# EAGLE design ETHIOLED (EAGLE 9.6.2)
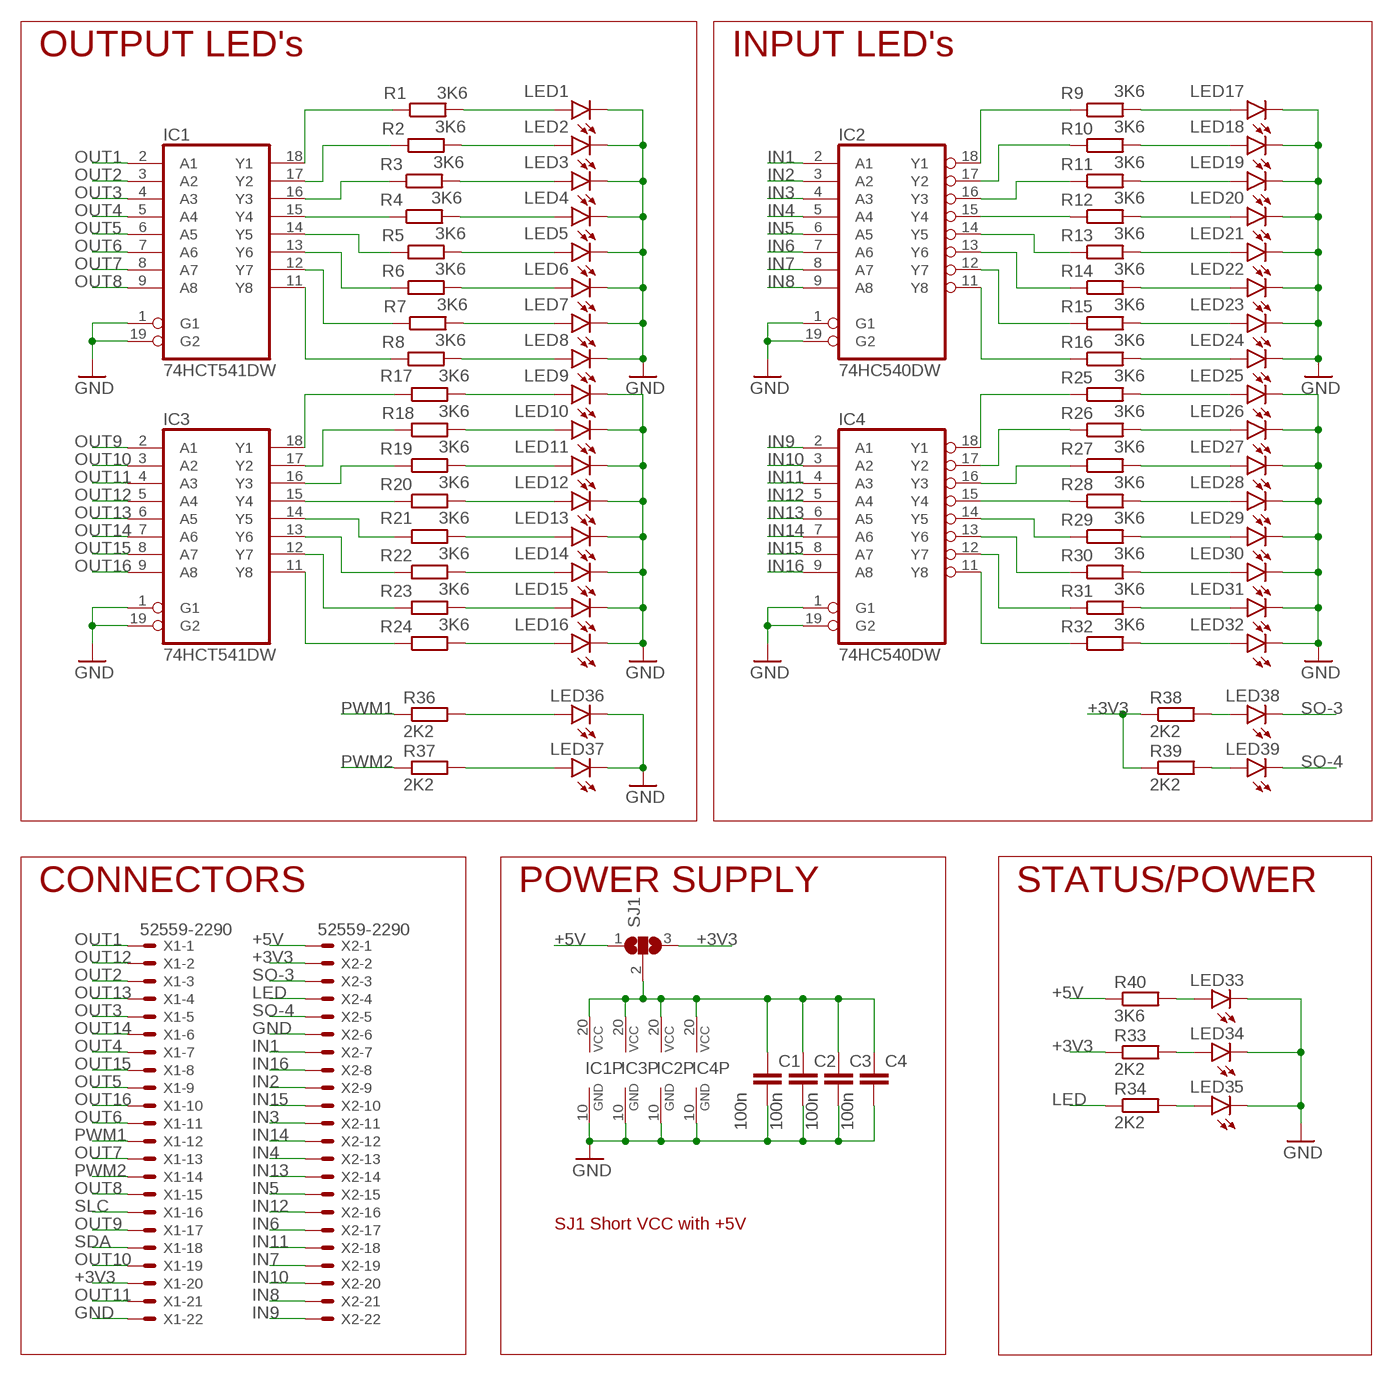
[diagram p0: schematic, sheet 1]

## Parts
C1  100n  C-EUC0805  [C0805]
C2  100n  C-EUC0805  [C0805]
C3  100n  C-EUC0805  [C0805]
C4  100n  C-EUC0805  [C0805]
IC1  74HCT541DW  [SO20W]
IC2  74HC540DW  [SO20W]
IC3  74HCT541DW  [SO20W]
IC4  74HC540DW  [SO20W]
LED1  LEDSML1206  [SML1206]
LED2  LEDSML1206  [SML1206]
LED3  LEDSML1206  [SML1206]
LED4  LEDSML1206  [SML1206]
LED5  LEDSML1206  [SML1206]
LED6  LEDSML1206  [SML1206]
LED7  LEDSML1206  [SML1206]
LED8  LEDSML1206  [SML1206]
LED9  LEDSML1206  [SML1206]
LED10  LEDSML1206  [SML1206]
LED11  LEDSML1206  [SML1206]
LED12  LEDSML1206  [SML1206]
LED13  LEDSML1206  [SML1206]
LED14  LEDSML1206  [SML1206]
LED15  LEDSML1206  [SML1206]
LED16  LEDSML1206  [SML1206]
LED17  LEDSML1206  [SML1206]
LED18  LEDSML1206  [SML1206]
LED19  LEDSML1206  [SML1206]
LED20  LEDSML1206  [SML1206]
LED21  LEDSML1206  [SML1206]
LED22  LEDSML1206  [SML1206]
LED23  LEDSML1206  [SML1206]
LED24  LEDSML1206  [SML1206]
LED25  LEDSML1206  [SML1206]
LED26  LEDSML1206  [SML1206]
LED27  LEDSML1206  [SML1206]
LED28  LEDSML1206  [SML1206]
LED29  LEDSML1206  [SML1206]
LED30  LEDSML1206  [SML1206]
LED31  LEDSML1206  [SML1206]
LED32  LEDSML1206  [SML1206]
LED33  LEDSML1206  [SML1206]
LED34  LEDSML1206  [SML1206]
LED35  LEDSML1206  [SML1206]
LED36  LEDSML1206  [SML1206]
LED37  LEDSML1206  [SML1206]
LED38  LEDSML1206  [SML1206]
LED39  LEDSML1206  [SML1206]
R1  3K6  R-EU_R0805  [R0805]
R2  3K6  R-EU_R0805  [R0805]
R3  3K6  R-EU_R0805  [R0805]
R4  3K6  R-EU_R0805  [R0805]
R5  3K6  R-EU_R0805  [R0805]
R6  3K6  R-EU_R0805  [R0805]
R7  3K6  R-EU_R0805  [R0805]
R8  3K6  R-EU_R0805  [R0805]
R9  3K6  R-EU_R0805  [R0805]
R10  3K6  R-EU_R0805  [R0805]
R11  3K6  R-EU_R0805  [R0805]
R12  3K6  R-EU_R0805  [R0805]
R13  3K6  R-EU_R0805  [R0805]
R14  3K6  R-EU_R0805  [R0805]
R15  3K6  R-EU_R0805  [R0805]
R16  3K6  R-EU_R0805  [R0805]
R17  3K6  R-EU_R0805  [R0805]
R18  3K6  R-EU_R0805  [R0805]
R19  3K6  R-EU_R0805  [R0805]
R20  3K6  R-EU_R0805  [R0805]
R21  3K6  R-EU_R0805  [R0805]
R22  3K6  R-EU_R0805  [R0805]
R23  3K6  R-EU_R0805  [R0805]
R24  3K6  R-EU_R0805  [R0805]
R25  3K6  R-EU_R0805  [R0805]
R26  3K6  R-EU_R0805  [R0805]
R27  3K6  R-EU_R0805  [R0805]
R28  3K6  R-EU_R0805  [R0805]
R29  3K6  R-EU_R0805  [R0805]
R30  3K6  R-EU_R0805  [R0805]
R31  3K6  R-EU_R0805  [R0805]
R32  3K6  R-EU_R0805  [R0805]
R33  2K2  R-EU_R1206  [R1206]
R34  2K2  R-EU_R1206  [R1206]
R36  2K2  R-EU_R0805  [R0805]
R37  2K2  R-EU_R0805  [R0805]
R38  2K2  R-EU_R0805  [R0805]
R39  2K2  R-EU_R0805  [R0805]
R40  3K6  R-EU_R1206  [R1206]
SJ1  SJ2W  [SJ_2]
X1  52559-2290  [52559-2290]
X2  52559-2290  [52559-2290]

## Nets
+3V3: R33.1 R38.1 R39.1 SJ1.3 X1.20 X2.2
+5V: R40.1 SJ1.1 X2.1
GND: C1.2 C2.2 C3.2 C4.2 IC1.1(G1) IC1.10(GND) IC1.19(G2) IC2.1(G1) IC2.10(GND) IC2.19(G2) IC3.1(G1) IC3.10(GND) IC3.19(G2) IC4.1(G1) IC4.10(GND) IC4.19(G2) LED1.C LED2.C LED3.C LED4.C LED5.C LED6.C LED7.C LED8.C LED9.C LED10.C LED11.C LED12.C LED13.C LED14.C LED15.C LED16.C LED17.C LED18.C LED19.C LED20.C LED21.C LED22.C LED23.C LED24.C LED25.C LED26.C LED27.C LED28.C LED29.C LED30.C LED31.C LED32.C LED33.C LED34.C LED35.C LED36.C LED37.C X1.22 X2.6
I1: IC2.18(Y1) R9.1
I16: IC4.11(Y8) R32.1
IN1: IC2.2(A1) X2.7
IN2: IC2.3(A2) X2.9
IN3: IC2.4(A3) X2.11
IN4: IC2.5(A4) X2.13
IN5: IC2.6(A5) X2.15
IN6: IC2.7(A6) X2.17
IN7: IC2.8(A7) X2.19
IN8: IC2.9(A8) X2.21
IN9: IC4.2(A1) X2.22
IN10: IC4.3(A2) X2.20
IN11: IC4.4(A3) X2.18
IN12: IC4.5(A4) X2.16
IN13: IC4.6(A5) X2.14
IN14: IC4.7(A6) X2.12
IN15: IC4.8(A7) X2.10
IN16: IC4.9(A8) X2.8
LED: R34.1 X2.4
N$2: IC3.12(Y7) R23.1
N$3: IC3.13(Y6) R22.1
N$4: IC3.14(Y5) R21.1
N$5: IC3.15(Y4) R20.1
N$6: IC3.16(Y3) R19.1
N$7: IC3.17(Y2) R18.1
N$8: IC3.18(Y1) R17.1
N$10: IC2.17(Y2) R10.1
N$11: IC2.16(Y3) R11.1
N$12: IC2.15(Y4) R12.1
N$13: IC2.14(Y5) R13.1
N$14: IC2.13(Y6) R14.1
N$15: IC2.12(Y7) R15.1
N$16: IC2.11(Y8) R16.1
N$17: IC1.11(Y8) R8.1
N$18: IC1.12(Y7) R7.1
N$19: IC1.13(Y6) R6.1
N$20: IC1.14(Y5) R5.1
N$21: IC1.15(Y4) R4.1
N$22: IC1.16(Y3) R3.1
N$23: IC1.17(Y2) R2.1
N$25: IC4.18(Y1) R25.1
N$26: IC4.17(Y2) R26.1
N$27: IC4.16(Y3) R27.1
N$28: IC4.15(Y4) R28.1
N$29: IC4.14(Y5) R29.1
N$30: IC4.13(Y6) R30.1
N$31: IC4.12(Y7) R31.1
N$33: LED1.A R1.2
N$34: LED2.A R2.2
N$35: LED3.A R3.2
N$36: LED4.A R4.2
N$37: LED5.A R5.2
N$38: LED6.A R6.2
N$39: LED7.A R7.2
N$40: LED8.A R8.2
N$41: LED36.A R36.2
N$42: LED37.A R37.2
N$43: LED9.A R17.2
N$44: LED10.A R18.2
N$45: LED11.A R19.2
N$46: LED12.A R20.2
N$47: LED13.A R21.2
N$48: LED14.A R22.2
N$49: LED15.A R23.2
N$50: LED16.A R24.2
N$51: LED17.A R9.2
N$52: LED18.A R10.2
N$53: LED19.A R11.2
N$54: LED20.A R12.2
N$55: LED21.A R13.2
N$56: LED22.A R14.2
N$57: LED23.A R15.2
N$58: LED24.A R16.2
N$59: LED25.A R25.2
N$60: LED26.A R26.2
N$61: LED27.A R27.2
N$62: LED28.A R28.2
N$63: LED29.A R29.2
N$64: LED30.A R30.2
N$65: LED31.A R31.2
N$66: LED32.A R32.2
N$67: LED33.A R40.2
N$68: LED34.A R33.2
N$69: C1.1 C2.1 C3.1 C4.1 IC1.20(VCC) IC2.20(VCC) IC3.20(VCC) IC4.20(VCC) SJ1.2
N$70: LED35.A R34.2
N$71: LED38.A R38.2
N$73: LED39.A R39.2
OUT1: IC1.2(A1) X1.1
OUT2: IC1.3(A2) X1.3
OUT3: IC1.4(A3) X1.5
OUT4: IC1.5(A4) X1.7
OUT5: IC1.6(A5) X1.9
OUT6: IC1.7(A6) X1.11
OUT7: IC1.8(A7) X1.13
OUT8: IC1.9(A8) X1.15
OUT9: IC3.2(A1) X1.17
OUT10: IC3.3(A2) X1.19
OUT11: IC3.4(A3) X1.21
OUT12: IC3.5(A4) X1.2
OUT13: IC3.6(A5) X1.4
OUT14: IC3.7(A6) X1.6
OUT15: IC3.8(A7) X1.8
OUT16: IC3.9(A8) X1.10
PWM1: R36.1 X1.12
PWM2: R37.1 X1.14
SDA: X1.18
SLC: X1.16
SO-3: LED38.C X2.3
SO-4: LED39.C X2.5
UT1: IC1.18(Y1) R1.1
UT16: IC3.11(Y8) R24.1

## Notes on the sheet
- OUTPUT LED's | INPUT LED's
- CONNECTORS | POWER SUPPLY | STATUS/POWER
- SJ1 Short VCC with +5V

## Library data of the parts
C1-C4 = rcl:C-EU: CAPACITOR, European symbol; SPICEPREFIX: C
IC1 IC3 = 74xx-eu:74*541: Octal BUFFER and LINE DRIVER, 3-state
IC2 IC4 = 74xx-eu:74*540: Inverting Octal BUFFER and LINE DRIVER, 3-state
LED1-LED39 = led:LED: LED OSRAM: - CHIPLED LG R971, LG N971, LY N971, LG Q971, LY Q971, LO R971, LY R971 LH N974, LH R974 LS Q976, LO Q976, LY Q976 LO Q996 - Hyper CHIPLED LW Q18S LB Q993, LB Q99A, LB R99A - SideLED LS A670, LO A670, LY A670, LG A670, LP A670 LB A673, LV A673, LT A673, LW A673 LH A674 LY A675 LS A676, LA A676, LO A676, LY A676, LW A676 LS A679, LY A679, LG A679 - Hyper Micro SIDELED® LS Y876, LA Y876, LO Y876, LY Y876 LT Y87S - SmartLED LW L88C, LW L88S LB L89C, LB L89S, LG L890 LS L89K, LO L89K, LY L89K LS L896, LA L896, LO L896, LY L896 - TOPLED LS T670, LO T670, LY T670, LG T670, LP T670 LSG T670, LSP T670, LSY T670, LOP T670, LYG T670 LG T671, LOG T671, LSG T671 LB T673, LV T673, LT T673, LW T673 LH T674 LS T676, LA T676, LO T676, LY T676, LB T676, LH T676, LSB T676, LW T676 LB T67C, LV T67C, LT T67C, LS T67K, LO T67K, LY T67K, LW E67C LS E67B, LA E67B, LO E67B, LY E67B, LB E67C, LV E67C, LT E67C LW T67C LS T679, LY T679, LG T679 LS T770, LO T770, LY T770, LG T770, LP T770 LB T773, LV T773, LT T773, LW T773 LH T774 LS E675, LA E675, LY E675, LS T675 LS T776, LA T776, LO T776, LY T776, LB T776 LHGB T686 LT T68C, LB T68C - Hyper Mini TOPLED® LB M676 - Mini TOPLED Santana® LG M470 LS M47K, LO M47K, LY M47K Source: http://www.osram.convergy.de LUXEON: - LUMILED® LXK2-PW12-R00, LXK2-PW12-S00, LXK2-PW14-U00, LXK2-PW14-V00 LXK2-PM12-R00, LXK2-PM12-S00, LXK2-PM14-U00 LXK2-PE12-Q00, LXK2-PE12-R00, LXK2-PE12-S00, LXK2-PE14-T00, LXK2-PE14-U00 LXK2-PB12-K00, LXK2-PB12-L00, LXK2-PB12-M00, LXK2-PB14-N00, LXK2-PB14-P00, LXK2-PB14-Q00 LXK2-PR12-L00, LXK2-PR12-M00, LXK2-PR14-Q00, LXK2-PR14-R00 LXK2-PD12-Q00, LXK2-PD12-R00, LXK2-PD12-S00 LXK2-PH12-R00, LXK2-PH12-S00 LXK2-PL12-P00, LXK2-PL12-Q00, LXK2-PL12-R00 Source: www.luxeon.com KINGBRIGHT: KA-3528ASYC Source: www.kingbright.com
R1-R34 R36-R40 = rcl:R-EU_: RESISTOR, European symbol; SPICEPREFIX: R
SJ1 = jumper:SJ2W: SMD solder JUMPER
X1 X2 = con-molex:52559-2290: FFC/FPC-to-Board 0.50mm (.020") SMT, Vertical, ZIF Receptacle Source: http://www.molex.com/product/ffc/52559.html; MF: MOLEX; MPN: 52559-2290; OC_FARNELL: unknown; OC_NEWARK: 92M6193

## Board
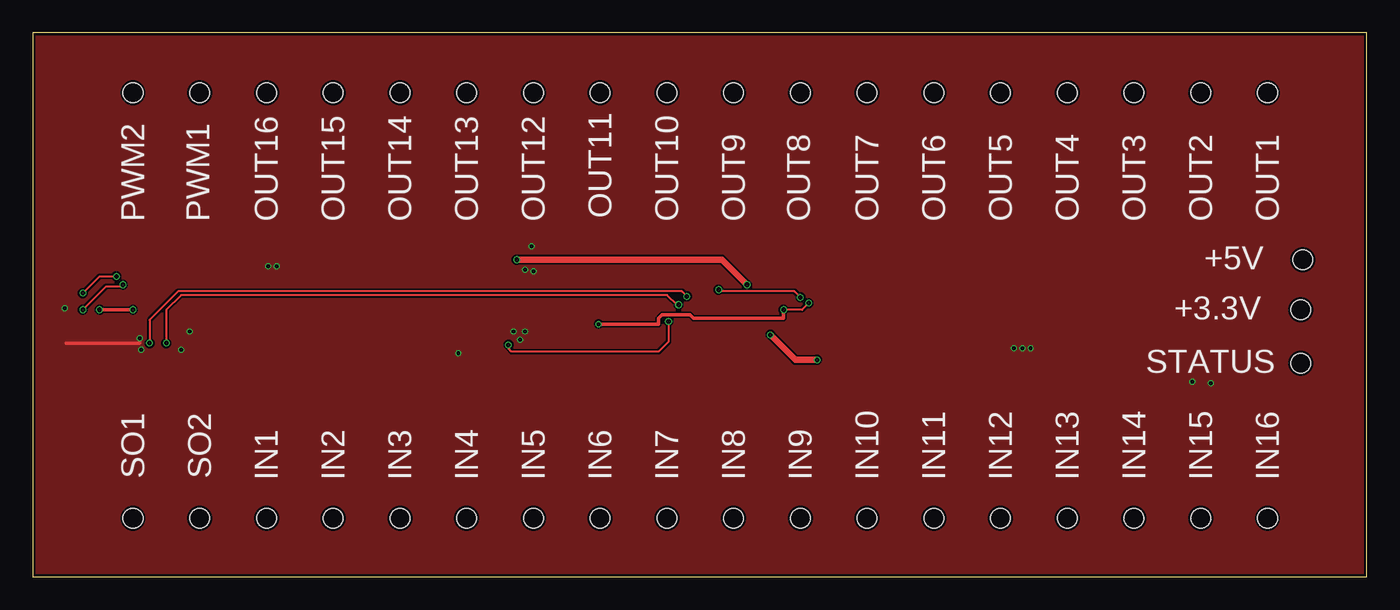
[diagram p1: board, top side]
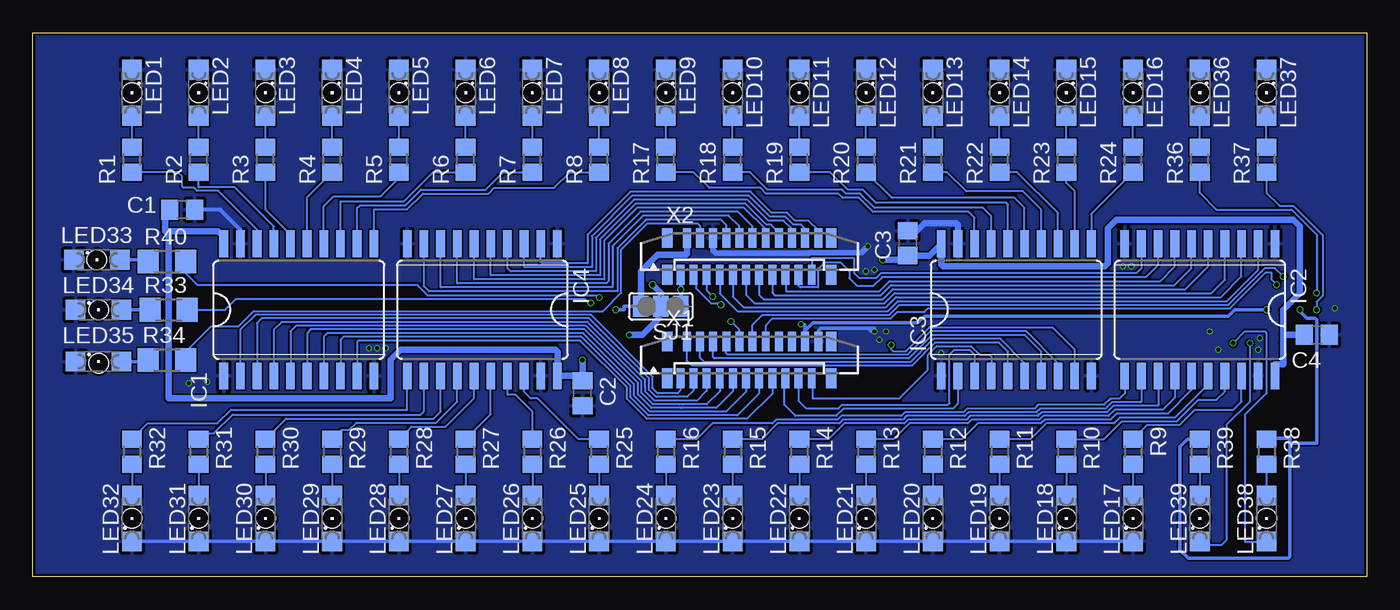
[diagram p2: board, bottom side, seen from below]

Size 101.52 x 41.39 mm. Coordinates in mm from the lower left corner, seen from the top.
Outline: 0,0 101.52,0 101.52,41.39 0,41.39 0,0
Copper layers (1*16): Top 0.035mm / dielectric 1.6mm / Bottom 0.035mm
Design rules "jlcpcb-2layers *": minimum track width 5mil, minimum drill 0.3mm, track to track 5mil, track to pad 5mil, pad to pad 5mil, via to via 5mil, smd to smd 5mil, copper to edge 0.2mm, drill to drill 6mil, minimum pad ring 10mil, minimum via ring 3mil, stop-mask expansion 4mil, vias tented up to drill 40mm, thermal gap 10mil
Holes 1.5 mm at 7.62,36.83 12.7,36.83 17.78,36.83 22.86,36.83 27.94,36.83 33.02,36.83 38.1,36.83 43.18,36.83 48.26,36.83 53.34,36.83 58.42,36.83 63.5,36.83 68.58,36.83 73.66,36.83 78.74,36.83 83.82,36.83 88.9,36.83 93.98,36.83 7.62,4.45 12.7,4.45 17.78,4.45 22.86,4.45 27.94,4.45 33.02,4.45 38.1,4.45 43.18,4.45 48.26,4.45 53.34,4.45 58.42,4.45 63.5,4.45 68.58,4.45 73.66,4.45 78.74,4.45 83.82,4.45 88.9,4.45 93.98,4.45 96.65,24.13 96.52,20.32 96.52,16.26

### Footprints (pad centres in the part's own frame; a part is rotated, then mirrored left to right if it is on the bottom)
C0805 = smd 1.3 x 1.5: 1 -0.95,0; 2 0.95,0
SO20W = smd 0.66 x 2.032: 1 -5.715,-5.029; 2 -4.445,-5.029; 3 -3.175,-5.029; 4 -1.905,-5.029; 5 -0.635,-5.029; 6 0.635,-5.029; 7 1.905,-5.029; 8 3.175,-5.029; 9 4.445,-5.029; 10 5.715,-5.029; 11 5.715,5.029; 12 4.445,5.029; 13 3.175,5.029; 14 1.905,5.029; 15 0.635,5.029; 16 -0.635,5.029; 17 -1.905,5.029; 18 -3.175,5.029; 19 -4.445,5.029; 20 -5.715,5.029
SML1206 = smd 1.5 x 1.5: A 1.75,0; C -1.75,0
R0805 = smd 1.3 x 1.5: 1 -0.95,0; 2 0.95,0
R1206 = smd 1.6 x 1.803: 1 -1.422,0; 2 1.422,0
SJ_2 = smd 1.168 x 1.6: 1 -1.524,0; 2 0,0; 3 1.524,0
52559-2290 = smd 0.6 x 1.5: 1 -5.25,-1.4; 2 -4.75,1.4; 3 -4.25,-1.4; 4 -3.75,1.4; 5 -3.25,-1.4; 6 -2.75,1.4; 7 -2.25,-1.4; 8 -1.75,1.4; 9 -1.25,-1.4; 10 -0.75,1.4; 11 -0.25,-1.4; 12 0.25,1.4; 13 0.75,-1.4; 14 1.25,1.4; 15 1.75,-1.4; 16 2.25,1.4; 17 2.75,-1.4; 18 3.25,1.4; 19 3.75,-1.4; 20 4.25,1.4; 21 4.75,-1.4; 22 5.25,1.4 | smd 0.8 x 1.5: M1 -6.25,-1.4; M2 6.25,-1.4; M3 6.25,1.4; M4 -6.25,1.4

### Placement (x,y rotation side)
C1  90.17,27.94 0 bottom
C2  59.69,13.97 270 bottom
C3  34.92,25.4 90 bottom
C4  3.81,18.41 0 bottom
IC1  81.28,20.32 0 bottom
IC2  12.7,20.32 180 bottom
IC3  26.67,20.32 0 bottom
IC4  67.31,20.32 180 bottom
LED1  93.98,36.83 270 bottom
LED2  88.9,36.83 270 bottom
LED3  83.82,36.83 270 bottom
LED4  78.74,36.83 270 bottom
LED5  73.66,36.83 270 bottom
LED6  68.58,36.83 270 bottom
LED7  63.5,36.83 270 bottom
LED8  58.42,36.83 270 bottom
LED9  53.34,36.83 270 bottom
LED10  48.26,36.83 270 bottom
LED11  43.18,36.83 270 bottom
LED12  38.1,36.83 270 bottom
LED13  33.02,36.83 270 bottom
LED14  27.94,36.83 270 bottom
LED15  22.86,36.83 270 bottom
LED16  17.78,36.83 270 bottom
LED17  17.78,4.45 90 bottom
LED18  22.86,4.45 90 bottom
LED19  27.94,4.45 90 bottom
LED20  33.02,4.45 90 bottom
LED21  38.1,4.45 90 bottom
LED22  43.18,4.45 90 bottom
LED23  48.26,4.45 90 bottom
LED24  53.34,4.45 90 bottom
LED25  58.42,4.45 90 bottom
LED26  63.5,4.45 90 bottom
LED27  68.58,4.45 90 bottom
LED28  73.66,4.45 90 bottom
LED29  78.74,4.45 90 bottom
LED30  83.82,4.45 90 bottom
LED31  88.9,4.45 90 bottom
LED32  93.98,4.45 90 bottom
LED33  96.65,24.13 0 bottom
LED34  96.52,20.32 0 bottom
LED35  96.52,16.38 0 bottom
LED36  12.7,36.83 270 bottom
LED37  7.62,36.83 270 bottom
LED38  7.62,4.45 90 bottom
LED39  12.7,4.45 90 bottom
R1  93.98,31.75 90 bottom
R2  88.9,31.75 90 bottom
R3  83.82,31.75 90 bottom
R4  78.74,31.75 90 bottom
R5  73.66,31.75 90 bottom
R6  68.58,31.75 90 bottom
R7  63.5,31.75 90 bottom
R8  58.42,31.75 90 bottom
R9  17.78,9.53 270 bottom
R10  22.86,9.53 270 bottom
R11  27.94,9.53 270 bottom
R12  33.02,9.53 270 bottom
R13  38.1,9.53 270 bottom
R14  43.18,9.53 270 bottom
R15  48.26,9.53 270 bottom
R16  53.34,9.53 270 bottom
R17  53.34,31.75 90 bottom
R18  48.26,31.75 90 bottom
R19  43.18,31.75 90 bottom
R20  38.1,31.75 90 bottom
R21  33.02,31.75 90 bottom
R22  27.94,31.75 90 bottom
R23  22.86,31.75 90 bottom
R24  17.78,31.75 90 bottom
R25  58.42,9.53 270 bottom
R26  63.5,9.53 270 bottom
R27  68.58,9.53 270 bottom
R28  73.66,9.53 270 bottom
R29  78.74,9.53 270 bottom
R30  83.82,9.53 270 bottom
R31  88.9,9.53 270 bottom
R32  93.98,9.53 270 bottom
R33  91.19,20.32 180 bottom
R34  91.31,16.51 180 bottom
R36  12.7,31.75 90 bottom
R37  7.62,31.75 90 bottom
R38  7.62,9.53 270 bottom
R39  12.7,9.53 270 bottom
R40  91.31,24 180 bottom
SJ1  53.72,20.57 180 bottom
X1  46.99,16.51 0 bottom
X2  46.99,24.38 0 bottom

### Tracks (layer width: path | path; a pad name or v marks a point on that pad's centre or on a via)
+3V3  (via drill 0.3, 0.35)
  Top 0.152: v59.05,20.83 58.55,20.32 v57.15,20.32
  Top 0.254: v5.08,20.32 v7.62,20.32 | v43.05,19.23 47.63,19.23 47.63,19.68 47.88,19.94 50.04,19.94 50.3,19.68 57.15,19.68 v57.15,20.32
  Bottom 0.152: v59.05,20.83 59.18,20.83 59.51,21.16 86.03,21.16 86.87,20.32 R33.1
  Bottom 0.254: R39.1 13.65,10.47 14.22,9.91 14.22,2.03 13.59,1.4 5.97,1.4 5.84,1.52 5.84,10.16 | 5.84,10.16 5.84,10.54 7.55,10.54 R38.1 | v5.08,20.32 5.13,20.27 5.13,20.24 4.57,19.68 3.94,19.68 3.81,19.56 3.81,10.16 5.84,10.16 | v7.62,20.32 10.05,20.32 10.53,19.84 33.63,19.84 34.14,19.33 42.14,19.33 42.74,18.73 X1.20 42.74,19.18 43.05,19.18 v43.05,19.23 | SJ1.3 56.52,20.57 56.52,20.32 v57.15,20.32
  Bottom 0.508: SJ1.3 55.24,23.24 53.98,24.51 51.82,24.51 51.74,24.59 X2.2
+5V  (via drill 0.35)
  Top 0.152: v58.42,21.26 57.97,21.72 52.2,21.72 v52.2,21.84
  Bottom 0.152: v58.42,21.26 58.42,21.44 71.49,21.44 72.28,22.23 89,22.23 89.89,23.11 R40.1
  Bottom 0.305: X2.1 52.2,22.94 v52.2,21.84 SJ1.1
GND  (via drill 0.3)
  Top 0.254: v8.13,18.16 8.13,17.78 2.54,17.78
  Bottom 0.254: LED17.C LED18.C LED19.C LED20.C LED21.C LED22.C LED23.C LED24.C LED25.C LED26.C LED27.C LED28.C LED29.C LED30.C LED31.C LED32.C | X1.22 41.74,18.71 41.53,18.92 37.97,18.92 | 37.72,18.67 37.97,18.92 | 37.97,18.92 37.47,18.92 v37.47,18.67
  Bottom 0.305: IC1.19 85.72,26.42 87.25,27.94 C1.2
  Bottom 0.406: X2.6 49.74,24.85 49.53,24.64 42.43,24.64 42.41,24.66 38.46,24.66 v37.97,25.15
  Bottom 0.508: C3.2 34.23,26.35 33.66,26.92 31.24,26.92 31.11,26.8 IC3.19
  other vias: 11.94,18.67 11.3,17.27 8.26,17.27 17.91,23.62 18.54,23.62 37.47,23.37 38.1,23.24 32.38,17.02 89.66,14.73 88.27,14.86 74.68,17.4 75.31,17.4 75.95,17.4 36.58,18.67 37.08,18.03 2.41,20.45
  pour Bottom: 0,41.4 101.47,41.4 101.47,0 0,0
  pour Top: 0,41.4 101.47,41.4 101.47,0 0,0
I1
  Bottom 0.152: IC2.18 9.53,13.34 10.16,12.7 13.08,12.7 14.22,11.56 16.7,11.56 R9.1
I16
  Bottom 0.152: R32.1 92.77,11.68 87.49,11.68 86.45,12.72 73.03,12.72 IC4.11
IN1
  Bottom 0.152: X2.7 49.24,21.55 47.9,20.22 36.45,20.22 35.69,20.98 10.64,20.98 8.26,23.37 IC2.2
IN2
  Bottom 0.152: X2.9 48.24,21.32 47.45,20.52 36.58,20.52 35.81,21.29 11.1,21.29 9.53,22.86 IC2.3
IN3
  Bottom 0.152: X2.11 47.24,21.46 46.61,20.83 36.7,20.83 35.94,21.59 11.81,21.59 10.79,22.61 IC2.4
IN4
  Bottom 0.152: X2.13 46.24,21.48 45.9,21.13 36.83,21.13 36.07,21.89 13.79,21.89 12.06,23.62 IC2.5
IN5
  Bottom 0.152: X2.15 45.24,21.62 45.06,21.44 36.96,21.44 36.2,22.2 14.63,22.2 13.34,23.5 IC2.6
IN6
  Bottom 0.152: X2.17 44.2,22.94 44.2,21.74 37.09,21.74 36.32,22.5 15.72,22.5 14.61,23.62 IC2.7
IN7
  Bottom 0.152: IC2.8 15.88,23.75 16.82,22.81 36.87,22.81 37.53,22.15 38.79,22.15 39.37,22.73 39.37,23.24 40.07,23.94 41.22,23.94 41.73,23.43 41.73,22.03 43.11,22.03 43.24,22.16 X2.19
IN8
  Bottom 0.152: IC2.9 17.14,23.5 17.53,23.11 36.96,23.11 37.34,22.73 38.61,22.73 38.99,23.11 38.99,24.26 42.24,24.26 X2.21
IN9
  Bottom 0.152: X2.22 41.74,26.37 42.47,27.1 43.51,27.1 44.12,27.71 45.29,27.71 46.89,29.31 56.03,29.31 59.31,26.04 59.31,23.85 62.74,23.85 62.87,23.98 IC4.2
IN10
  Bottom 0.152: X2.20 42.74,26.48 43.05,26.8 43.64,26.8 44.25,27.41 45.42,27.41 47.02,29.01 55.9,29.01 58.98,25.93 58.98,23.55 64.06,23.55 64.14,23.62 IC4.3
IN11
  Bottom 0.152: X2.18 43.74,26.47 44.37,27.1 45.54,27.1 47.14,28.7 55.78,28.7 58.67,25.8 58.67,23.24 65.15,23.24 65.41,23.5 IC4.4
IN12
  Bottom 0.152: X2.16 44.74,26.2 45.34,26.8 45.67,26.8 47.27,28.4 55.65,28.4 58.34,25.7 58.34,22.94 66.67,22.94 IC4.5
IN13
  Bottom 0.152: X2.14 45.74,26.44 47.4,28.09 55.52,28.09 58.04,25.58 58.04,22.63 67.94,22.63 IC4.6
IN14
  Bottom 0.152: X2.12 46.74,26.67 47.85,27.79 55.27,27.79 57.71,25.35 57.71,22.48 57.86,22.33 69.22,22.33 IC4.7
IN15
  Bottom 0.152: X2.10 47.74,26.66 48.56,27.48 55.08,27.48 57.4,25.16 57.4,22.02 70.48,22.02 IC4.8
IN16
  Bottom 0.152: X2.8 48.74,26.77 49.15,27.18 54.86,27.18 57.02,25.02 57.02,21.72 71.37,21.72 71.75,22.1 IC4.9
LED
  Bottom 0.152: X2.4 50.74,26.71 50.93,26.9 54.75,26.9 56.74,24.9 56.74,21.6 58.13,20.22 84.7,20.22 85.87,19.05 87.95,19.05 89.89,17.11 R34.1
N$2
  Bottom 0.152: IC3.12 22.23,29.34 22.86,29.97 R23.1
N$3
  Bottom 0.152: IC3.13 23.5,27.69 26.61,30.8 R22.1
N$4
  Bottom 0.152: IC3.14 24.77,27.94 26.16,29.34 30.48,29.34 31.94,30.8 R21.1
N$5
  Bottom 0.152: IC3.15 26.04,28.07 26.8,28.83 36.13,28.83 R20.1
N$6
  Bottom 0.152: IC3.16 27.3,28.32 27.43,28.45 37.34,28.45 38.35,29.46 39.5,29.46 40.83,30.8 R19.1
N$7
  Bottom 0.152: IC3.17 28.57,27.43 29.21,28.07 37.47,28.07 38.56,29.16 39.62,29.16 39.93,29.46 45.59,29.46 46.93,30.8 R18.1
N$8
  Bottom 0.152: IC3.18 29.84,27.3 30.3,27.76 37.59,27.76 38.66,28.83 39.88,28.83 40.21,29.16 45.72,29.16 46.15,29.59 50.04,29.59 51.25,30.8 R17.1
N$10
  Bottom 0.152: R10.1 20,10.47 18.64,11.84 14.45,11.84 12.83,13.46 11.43,13.46 10.79,14.1 IC2.17
N$11
  Bottom 0.152: IC2.16 12.06,14.66 14.61,12.12 18.8,12.12 19.23,11.68 24.38,11.68 25.59,10.47 R11.1
N$12
  Bottom 0.152: IC2.15 13.34,14.22 15.14,12.42 19.05,12.42 19.51,11.96 24.5,11.96 24.78,11.68 29.59,11.68 30.8,10.47 R12.1
N$13
  Bottom 0.152: IC2.14 14.61,13.64 15.52,12.72 19.17,12.72 19.65,12.24 24.61,12.24 24.89,11.96 30.07,11.96 30.35,11.68 34.8,11.68 36.01,10.47 R13.1
N$14
  Bottom 0.152: IC2.13 15.88,13.03 15.9,13.01 19.28,13.01 19.76,12.52 24.73,12.52 25.01,12.24 30.19,12.24 30.47,11.96 34.91,11.96 35.19,11.68 39.75,11.68 40.96,10.47 R14.1
N$15
  Bottom 0.152: IC2.12 17.14,13.34 17.2,13.28 19.4,13.28 19.88,12.8 24.85,12.8 25.13,12.52 30.3,12.52 30.58,12.24 35.03,12.24 35.31,11.96 39.87,11.96 40.15,11.68 44.83,11.68 46.04,10.47 R15.1
N$16
  Bottom 0.152: IC2.11 18.41,13.97 18.82,13.56 19.51,13.56 19.65,13.43 20,13.08 25.02,13.08 25.3,12.8 30.42,12.8 30.7,12.52 35.15,12.52 35.42,12.24 39.98,12.24 40.26,11.96 44.95,11.96 45.23,11.68 49.78,11.68 50.99,10.47 R16.1
N$17
  Bottom 0.152: IC1.11 75.56,27.94 75.54,27.96 73.03,27.96 71.83,29.16 66.85,29.16 66.42,29.59 61.85,29.59 60.64,30.8 R8.1
N$18
  Bottom 0.152: IC1.12 76.83,28.07 76.63,28.27 73.15,28.27 71.96,29.46 67.06,29.46 65.72,30.8 R7.1
N$19
  Bottom 0.152: IC1.13 78.11,28.57 73.28,28.57 71.05,30.8 R6.1
N$20
  Bottom 0.152: IC1.14 79.38,28.19 78.61,28.96 75.06,28.96 73.66,30.35 R5.1
N$21
  Bottom 0.152: IC1.15 80.64,28.89 R4.1
N$22
  Bottom 0.152: IC1.16 81.92,26.04 83.82,27.94 R3.1
N$23
  Bottom 0.152: IC1.17 83.19,26.67 86.16,29.64 88.9,29.64 R2.1
N$25
  Bottom 0.152: IC4.18 64.14,14.1 63.63,13.59 63.5,13.59 63.12,13.59 60.01,10.47 R25.1
N$26
  Bottom 0.152: R26.1 63.5,12.57 64.77,13.84 65.41,13.84 IC4.17
N$27
  Bottom 0.152: R27.1 66.67,12.38 IC4.16
N$28
  Bottom 0.152: R28.1 72.7,11.43 70.1,11.43 67.94,13.59 IC4.15
N$29
  Bottom 0.152: R29.1 78.04,11.18 77.45,11.18 76.89,11.73 70.81,11.73 69.22,13.34 IC4.14
N$30
  Bottom 0.152: R30.1 82.25,12.04 71.02,12.04 70.48,12.57 IC4.13
N$31
  Bottom 0.152: R31.1 88.45,10.92 87.74,10.92 86.32,12.34 72.01,12.34 71.75,12.6 IC4.12
N$33
  Bottom 0.152: R1.2 LED1.A
N$34
  Bottom 0.152: R2.2 LED2.A
N$35
  Bottom 0.152: R3.2 LED3.A
N$36
  Bottom 0.152: R4.2 LED4.A
N$37
  Bottom 0.152: R5.2 LED5.A
N$38
  Bottom 0.152: R6.2 LED6.A
N$39
  Bottom 0.152: R7.2 LED7.A
N$40
  Bottom 0.152: R8.2 LED8.A
N$41
  Bottom 0.152: R36.2 LED36.A
N$42
  Bottom 0.152: R37.2 LED37.A
N$43
  Bottom 0.152: R17.2 LED9.A
N$44
  Bottom 0.152: R18.2 LED10.A
N$45
  Bottom 0.152: R19.2 LED11.A
N$46
  Bottom 0.152: R20.2 LED12.A
N$47
  Bottom 0.152: R21.2 LED13.A
N$48
  Bottom 0.152: R22.2 LED14.A
N$49
  Bottom 0.152: R23.2 LED15.A
N$50
  Bottom 0.152: R24.2 LED16.A
N$51
  Bottom 0.152: R9.2 LED17.A
N$52
  Bottom 0.152: R10.2 LED18.A
N$53
  Bottom 0.152: R11.2 LED19.A
N$54
  Bottom 0.152: R12.2 LED20.A
N$55
  Bottom 0.152: R13.2 LED21.A
N$56
  Bottom 0.152: R14.2 LED22.A
N$57
  Bottom 0.152: R15.2 LED23.A
N$58
  Bottom 0.152: R16.2 LED24.A
N$59
  Bottom 0.152: R25.2 LED25.A
N$60
  Bottom 0.152: R26.2 LED26.A
N$61
  Bottom 0.152: R27.2 LED27.A
N$62
  Bottom 0.152: R28.2 LED28.A
N$63
  Bottom 0.152: R29.2 LED29.A
N$64
  Bottom 0.152: R30.2 LED30.A
N$65
  Bottom 0.152: R31.2 LED31.A
N$66
  Bottom 0.152: R32.2 LED32.A
N$67
  Bottom 0.254: LED33.A 92.86,24.13 R40.2
N$68
  Bottom 0.254: R33.2 LED34.A
N$69  (via drill 0.35)
  Top 0.508: v56.13,18.41 58.04,16.51 v59.69,16.51 | v54.36,22.23 52.45,24.13 v36.83,24.13
  Bottom 0.305: IC1.20 87,25.78 86.96,25.82
  Bottom 0.508: v59.69,16.51 C2.1 60.06,15.29 IC4.20 61.59,17.14 61.72,17.27 73.53,17.27 74.3,16.51 74.3,13.59 91.19,13.59 91.19,26.29 | 86.96,25.82 87.43,26.29 91.19,26.29 | 91.19,26.29 91.44,26.29 91.44,27.62 C1.1 | v54.36,22.23 53.72,21.59 SJ1.2 53.91,20.38 53.91,19.62 55.12,18.41 v56.13,18.41 | v36.83,24.13 35.24,24.13 C3.1 33.28,24.45 IC3.20 32.38,23.75 32.26,23.62 19.94,23.62 19.68,23.88 19.68,26.54 19.05,27.18 5.59,27.18 5.08,26.67 5.08,21.59 6.35,20.32 6.35,18.41 | IC2.20 6.99,16.19 6.35,16.19 6.35,17.78 6.35,18.41 | C4.1 6.35,18.41
N$70
  Bottom 0.254: LED35.A 92.86,16.38 R34.2
N$71
  Bottom 0.152: R38.2 LED38.A
N$73
  Bottom 0.152: R39.2 LED39.A
OUT1
  Bottom 0.152: X1.1 52.24,14.18 52.45,13.97 53.98,13.97 54.36,14.35 54.36,15.24 59.05,19.94 84.58,19.94 85.72,18.8 IC1.2
OUT2
  Bottom 0.152: X1.3 51.24,14.16 51.71,13.69 54.09,13.69 54.63,14.23 54.63,15.12 59.17,19.66 84.1,19.66 84.45,19.3 IC1.3
OUT3
  Bottom 0.152: X1.5 50.24,14.15 50.98,13.41 54.21,13.41 54.91,14.12 54.91,14.48 54.91,15.01 59.29,19.38 82.6,19.38 83.19,18.8 IC1.4
OUT4
  Bottom 0.152: X1.7 49.24,14.13 50.24,13.13 52.07,13.13 52.32,13.13 54.32,13.13 55.19,14 55.19,14.89 59.4,19.1 81.48,19.1 81.92,18.67 IC1.5
OUT5
  Bottom 0.152: X1.9 48.24,14.12 49.51,12.85 52.07,12.85 52.2,12.85 54.44,12.85 55.47,13.89 55.47,14.78 59.52,18.82 80.37,18.82 80.64,18.54 IC1.6
OUT6
  Bottom 0.152: X1.11 47.24,14.1 48.77,12.57 54.55,12.57 55.75,13.77 55.75,14.66 59.63,18.54 79.12,18.54 79.38,18.29 IC1.7
OUT7
  Bottom 0.152: X1.13 46.24,13.98 46.23,13.97 47.9,12.29 54.67,12.29 56.03,13.66 56.03,14.55 59.75,18.26 77.88,18.26 78.11,18.03 IC1.8
OUT8
  Bottom 0.152: X1.15 45.24,13.94 47.17,12.01 54.78,12.01 56.31,13.54 56.31,14.43 59.87,17.98 76.76,17.98 76.83,17.91 IC1.9
OUT9
  Bottom 0.152: IC3.2 31.11,13.18 31.5,12.8 39.82,12.8 40.38,12.24 43.48,12.24 44.32,13.08 44.32,15.03 X1.17
OUT10
  Bottom 0.152: X1.19 43.24,13.39 42.67,12.83 40.19,12.83 39.94,13.08 31.88,13.08 31.75,13.21 31.75,16.89 31.37,17.27 30.23,17.27 29.84,16.89 IC3.3
OUT11
  Bottom 0.152: X1.21 42.16,15.03 42.16,13.59 35.56,13.59 33.4,15.75 33.4,16.89 32.74,17.55 30.11,17.55 29.45,16.89 28.7,16.89 28.57,16.76 IC3.4
OUT12
  Bottom 0.152: IC3.5 27.3,17.14 27.99,17.83 32.86,17.83 33.68,17.01 33.68,16.99 34.61,16.06 51.37,16.06 51.74,16.43 X1.2
OUT13
  Bottom 0.152: IC3.6 26.04,16.27 27.88,18.11 32.97,18.11 33.96,17.12 33.96,17.11 34.73,16.34 50.42,16.34 50.74,16.66 X1.4
OUT14
  Bottom 0.152: IC3.7 24.77,17.14 26.01,18.39 33.09,18.39 34.85,16.62 49.64,16.62 49.74,16.72 X1.6
OUT15
  Bottom 0.152: IC3.8 23.5,16.27 25.89,18.67 33.2,18.67 34.97,16.9 48.65,16.9 48.77,17.02 48.77,17.88 X1.8
OUT16  (via drill 0.35)
  Top 0.152: v48.39,19.43 48.39,17.91 47.62,17.14 36.45,17.14 36.2,17.4 v36.2,17.65
  Bottom 0.152: IC3.9 22.23,17.27 23.9,18.95 33.32,18.95 35.09,17.18 36.07,17.18 36.2,17.31 v36.2,17.65 | X1.10 47.74,18.78 v48.39,19.43
PWM1  (via drill 0.35)
  Top 0.152: v3.81,21.59 5.08,22.86 v6.35,22.86
  Bottom 0.152: X1.12 46.74,19.17 45.97,19.94 36.34,19.94 35.57,20.7 10.53,20.7 7.98,23.25 7.98,23.27 7.75,23.5 6.99,23.5 v6.35,22.86 | R36.1 12.7,29.21 11.43,27.94 5.7,27.94 3.81,26.05 v3.81,21.59
PWM2  (via drill 0.35)
  Top 0.152: v3.81,20.32 5.59,22.1 6.73,22.1 v6.86,22.23
  Bottom 0.152: X1.14 45.74,19.13 45.21,19.66 36.22,19.66 35.71,20.17 33.66,20.17 33.4,20.42 10.41,20.42 7.7,23.14 7.26,23.14 7.24,23.11 7.24,22.61 v6.86,22.23 | R37.1 7.62,29.21 6.63,28.22 5.59,28.22 3.36,25.99 3.36,21.4 3.81,20.95 v3.81,20.32
SO-3  (via drill 0.35)
  Top 0.152: v49.15,20.7 49.02,20.7 48.28,21.44 11.28,21.44 10.16,20.32 v10.16,17.78
  Bottom 0.152: X2.3 51.05,22.8 51.05,21.96 49.92,20.83 49.15,20.83 v49.15,20.7 | v10.16,17.78 9.27,18.67 7.75,18.67 7.62,18.54 7.62,13.97 9.27,12.32 9.27,2.67 7.65,2.67 LED38.C
SO-4  (via drill 0.35)
  Top 0.152: v49.78,21.34 49.4,21.72 11.05,21.72 8.89,19.56 v8.89,17.78
  Bottom 0.152: X2.5 50.24,21.79 v49.78,21.34 | LED39.C 12.42,2.41 11.05,2.41 10.67,2.79 10.67,11.56 8.89,13.34 v8.89,17.78
UT1
  Bottom 0.152: IC1.18 84.45,26.42 87.4,29.36 89.02,29.36 89.24,29.59 90.04,29.59 90.17,29.72 90.17,30.48 90.49,30.8 R1.1
UT16
  Bottom 0.152: R24.1 20.95,27.62 IC3.11

### Text on the board
tNames: PWM2 | PWM1 | OUT16 | OUT15 | OUT14 | OUT13 | OUT12 | OUT11 | OUT10 | OUT9 | OUT8 | OUT7 | OUT6 | OUT5 | OUT4 | OUT3 | OUT2 | OUT1 | +5V | +3.3V | STATUS | SO1 | SO2 | IN1 | IN2 | IN3 | IN4 | IN5 | IN6 | IN7 | IN8 | IN9 | IN10 | IN11 | IN12 | IN13 | IN14 | IN15 | IN16